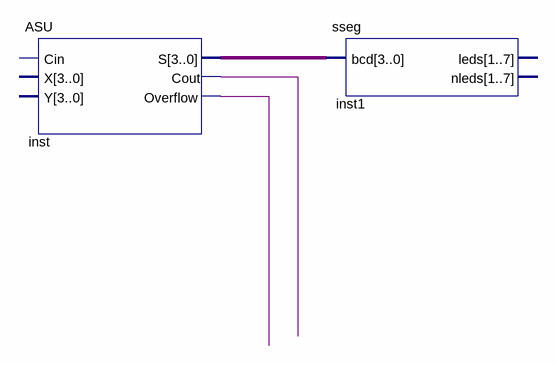
[diagram p0: schematic sheet]
// Quartus schematic lab3.bdf as structural Verilog: 2 symbols, 0 pins
module lab3 (
);

  wire inst_cout, inst_overflow;
  wire [3:0] inst_s;

  ASU inst (.S(inst_s), .Cout(inst_cout), .Overflow(inst_overflow));  // open: Cin, X, Y
  sseg inst1 (.bcd(inst_s));  // open: leds, nleds
endmodule
